# Altium schematic sheet HFPB_01, PAGE-1.SchDoc: Power Board (part 2 of 2)
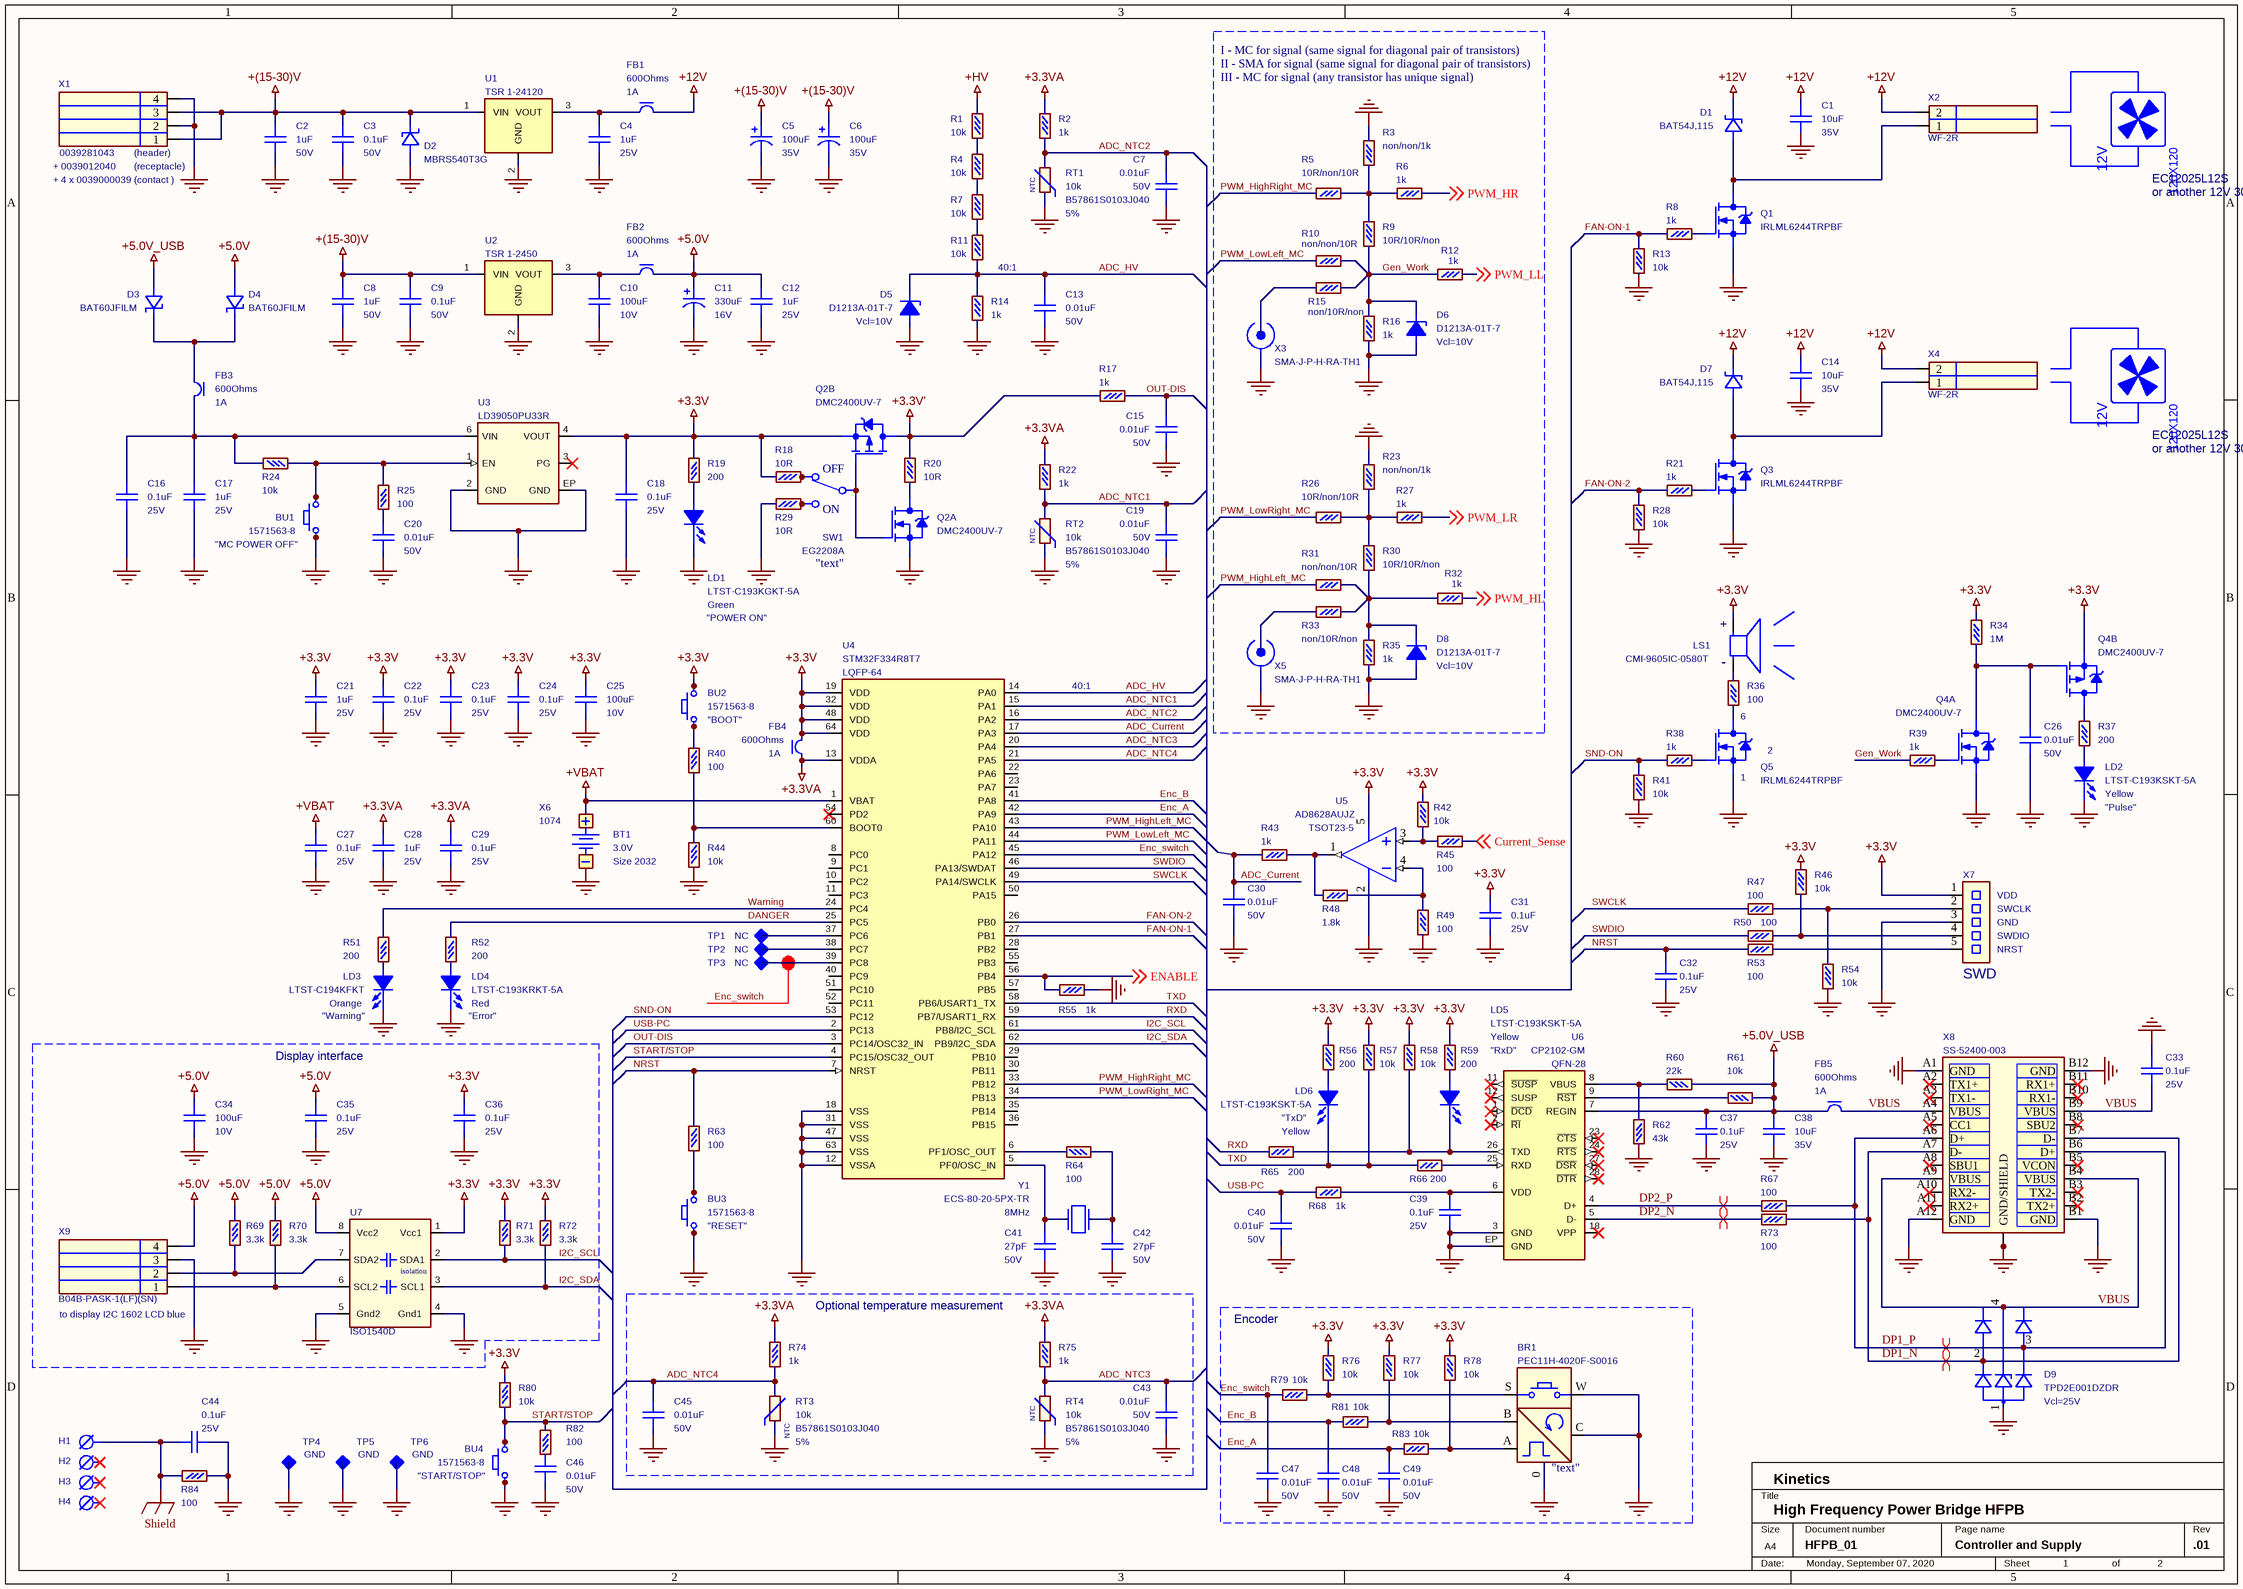
[diagram p1: HFPB_01, PAGE-1.SchDoc]

## Library data of the parts
BR1 = PEC11H-4020F-S0016: Encoder Mechanical 16 PPR; Manufacturer: BOURNS; CompType: Switch; Alternative: *; Comment for circuit: *; Datasheet link: https://www.bourns.com/docs/Product-Datasheets/PEC11H.pdf; Digikey link: https://www.digikey.com/en/products/detail/bourns-inc/PEC11H-4020F-S0016/12349534?s=N4IgTCBcDaIAoFEDCBGFAJAtAFgAxlwDFMBlXXFANhAF0BfIA; Digikey number: 118-PEC11H-4020F-S0016-ND; Mouser link: https://www.mouser.com/ProductDetail/Bourns/PEC11H-4020F-S0016?qs=%2Fha2pyFadugXOIYgpT6d2kofLXwYK1YHwuBrkfy8sJ82SNO9kJXzL6bNe4VLuBIA; Mouser number: 652-PEC11H4020FS0016; Package/Case: Through Hole; Part Description: Encoder Mechanical 16 PPR; Part number: PEC11H-4020F-S0016; Price per 1p (1), $: 2.75; Price per 1p (1000), $: 1.5
BT1 = CR2032: Battery CR2032; Manufacturer: * (Panasonic); Part Description: CR2032 Lithium; CompType: Battery 18650 Li-Pol; Value1: *mA*h; Part number: *; Value: 3.0V; Package/Case: *; Datasheet link: *; Price per 1p (1), $: *; Price per 1p (1000), $: *; Comment for circuit: *; Mouser number: *; Digikey number: *; Alternative: *; Digikey link: *; Mouser link: *
BU1-BU4 = 1571563-8: Switch tactile OFF-(ON) 0.05A 24V; Manufacturer: TE Connectivity; Part Description: Switch tactile 6.0x6.0x5.0mm; CompType: Switch; Alternative: *; Comment for circuit: *; Datasheet link: https://www.te.com/commerce/DocumentDelivery/DDEController?Action=srchrtrv&DocNm=2-1437565-7&DocType=Customer+Drawing&DocLang=English; Digikey link: https://www.digikey.com/product-detail/en/te-connectivity-alcoswitch-switches/1571563-8/450-2056-1-ND/4569746; Digikey number: 450-2056-1-ND; Mouser link: https://www.mouser.com/ProductDetail/TE-Connectivity-PB/1571563-8?qs=%2Fha2pyFaduj0OuietpPA40kWGM%2FYIDp1pjMEPmW2uQg=; Mouser number: 506-1571563-8; Package/Case: SMD 6.0x6.00; Part number: 1571563-8; Price per 1p (1), $: 0.3; Price per 1p (1000), $: 0.2
C1 C14 C38 = C1210: Capacitor 1210; Part number: C1210C106M6PACTU; Manufacturer: KEMET; Part Description: Ceramic 10uF 20% X5R 35V; Value1: 20%; Value2: X5R; CompType: Capacitor; Value: 10uF; Package/Case: SMD1210; Datasheet link: https://content.kemet.com/datasheets/KEM_C1006_X5R_SMD.pdf; Price per 1p (1), $: 0.96; Price per 1p (1000), $: 0.32; Comment for circuit: *; Mouser number: 80-C1210C106M6P; Digikey number: 399-5509-1-ND; Alternative: *; Digikey link: https://www.digikey.com/en/products/detail/kemet/C1210C106M6PACTU/1950669; Mouser link: https://www.mouser.com/ProductDetail/KEMET/C1210C106M6PACTU?qs=%2Fha2pyFaduiE5F3NeAx%252BstNZ0BfneUhBxisAs3aM8TbgY%252BzsDA%2Fe1Q%3D%3D
C2 C8 = C0603: Capacitor 0603; Part number: GRT188R61H105KE13D; Manufacturer: Murata; Part Description: Ceramic 1uF 10% X5R 50V; Value1: 10%; Value2: X5R; CompType: Capacitor; Value: 1uF; Package/Case: SMD0603; Datasheet link: https://search.murata.co.jp/Ceramy/image/img/A01X/G101/ENG/GRT188R61H105KE13-01.pdf; Price per 1p (1), $: 0.26; Price per 1p (1000), $: 0.05; Comment for circuit: *; Mouser number: 81-GRT188R61H105KE3D; Digikey number: 490-12330-1-ND; Alternative: *; Digikey link: https://www.digikey.com/en/products/detail/murata-electronics/GRT188R61H105KE13D/5416752; Mouser link: https://www.mouser.com/ProductDetail/Murata-Electronics/GRT188R61H105KE13D?qs=%2Fha2pyFaduhFE6YphrUpxtZHcvtFLtW5%252BvZuAhz4RSuwDm7lX%252BAYM08BAcXMzrSJ
C3 C9 = C0603: Capacitor 0603; Part number: C0603C104K5RAC7082; Manufacturer: KEMET; Part Description: Ceramic 0.1uF 10% X7R 50V; Value1: 10%; Value2: X7R; CompType: Capacitor; Value: 0.1uF; Package/Case: SMD0603; Datasheet link: https://content.kemet.com/datasheets/KEM_C1002_X7R_SMD.pdf; Price per 1p (1), $: 0.12; Price per 1p (1000), $: 0.02; Comment for circuit: *; Mouser number: 80-C0603C104K5R7082; Digikey number: 399-C0603C104K5RAC7082CT-ND; Alternative: *; Digikey link: https://www.digikey.com/en/products/detail/kemet/C0603C104K5RAC7082/12701309; Mouser link: https://www.mouser.com/ProductDetail/KEMET/C0603C104K5RAC7082?qs=%2Fha2pyFadugh8U7pV%252BrBGqKQVo7gfMZW%2Fweu8z7AvYympDvL%2Flu68oQ8xJ7whdD7
C4 C12 C17 C21 C28 = C0603: Capacitor 0603; Part number: C1608X7R1E105K080AB; Manufacturer: TDK; Part Description: Ceramic 1uF 10% X7R 25V; Value1: 10%; Value2: X7R; CompType: Capacitor; Value: 1uF; Package/Case: SMD0603; Datasheet link: https://product.tdk.com/en/system/files?file=dam/doc/product/capacitor/ceramic/mlcc/catalog/mlcc_commercial_general_en.pdf; Price per 1p (1), $: 0.21; Price per 1p (1000), $: 0.04; Comment for circuit: *; Mouser number: 810-C1608X7R1E105K; Digikey number: 445-5956-1-ND; Alternative: *; Digikey link: https://www.digikey.com/en/products/detail/tdk-corporation/C1608X7R1E105K080AB/2443434; Mouser link: https://www.mouser.com/ProductDetail/TDK/C1608X7R1E105K080AB?qs=%2Fha2pyFaduhbvUZXXxHSPKihux7pk%2FWVkCyG6jxauGMJh0GxUX0uaQUYqa1ofngF
C5 C6 = RL81V101MDN1KX: Capacitor Polymer Radial 100µF 35V 25mOhm; Manufacturer: Nichicon; Part Description: Polymer Radial 100µF 20% 35V 25mOhm 2000h; Value1: 2000h; Alternative: B41851F7227M000, JRB1V221M03500800120000B; Part number: RL81V101MDN1KX; Value2: 25mOhm; CompType: Capacitor; Value: 100uF; Package/Case: Radial, T/H 8.0x8.0; Datasheet link: http://nichicon-us.com/english/products/pdfs/e-rl8.pdf; Price per 1p (1), $: 2.16; Price per 1p (1000), $: 0.8; Comment for circuit: *; Mouser number: 647-RL81V101MDN1KX; Digikey number: 493-6630-1-ND; Digikey link: https://www.digikey.com/product-detail/en/nichicon/RL81V101MDN1KX/493-6630-1-ND/3466042; Mouser link: https://www.mouser.com/ProductDetail/Nichicon/RL81V101MDN1KX?qs=%2Fha2pyFadujp0wmh1eHJ4ZrOTMwlEdyH9TEHOdF6JjuEMP2hoF4V1g%3D%3D
C7 C13 C15 C19 C20 C26 C30 C40 C43 C45-C49 = C0603: Capacitor 0603; Part number: GRM1885C1H103JA01D; Manufacturer: Murata; Part Description: Ceramic 0.01uF 5% NP0 50V; Value1: 5%; Value2: NP0; CompType: Capacitor; Value: 0.01uF; Package/Case: SMD0603; Datasheet link: https://www.murata.com/-/media/webrenewal/support/library/catalog/products/capacitor/ceramiccapacitor/c02e.ashx?la=en-us&cvid=20210120024548000000; Price per 1p (1), $: 0.2; Price per 1p (1000), $: 0.04; Comment for circuit: *; Mouser number: 81-GRM1885C1H103JA1D; Digikey number: 490-9666-1-ND; Alternative: *; Digikey link: https://www.digikey.com/en/products/detail/murata-electronics/GRM1885C1H103JA01D/4421555; Mouser link: https://www.mouser.com/ProductDetail/Murata-Electronics/GRM1885C1H103JA01D?qs=%2Fha2pyFadug%2FvrC4VCXnldPdhfCgZBWBzBuM%2F5wKCqYfrzyFGWQkMbFjDTwqfUhJ
C10 C25 C34 = C1210: Capacitor 1210; Part number: C1210C107M8PACTU; Manufacturer: KEMET; Part Description: Ceramic 100uF 20% X5R 10V; Value1: 20%; Value2: X5R; CompType: Capacitor; Value: 100uF; Package/Case: SMD1210; Datasheet link: https://content.kemet.com/datasheets/KEM_C1006_X5R_SMD.pdf; Price per 1p (1), $: 1.50; Price per 1p (1000), $: 0.6; Comment for circuit: *; Mouser number: 80-C1210C107M8P; Digikey number: 399-11631-1-ND; Alternative: *; Digikey link: https://www.digikey.com/en/products/detail/kemet/C1210C107M8PACTU/4918884; Mouser link: https://www.mouser.com/ProductDetail/KEMET/C1210C107M8PACTU?qs=%2Fha2pyFaduiE5F3NeAx%252BsprSoAdidwO3b%2FrC%252BOmtqFrT1TfrhYgUKA%3D%3D
C11 = RL81C331MDN1KX: Capacitor Polymer Radial 330µF 16V 12mOhm; Manufacturer: Nichicon; Part Description: Polymer Radial 330µF 20% 16V 12mOhm 2000h; Value1: 2000h; Alternative: JRB1C681M03500800160000B; Part number: RL81C331MDN1KX; Value2: 12mOhm; CompType: Capacitor; Value: 330uF; Package/Case: Radial, T/H 9.0x8.0; Datasheet link: https://www.nichicon.co.jp/english/products/pdfs/e-rl8.pdf; Price per 1p (1), $: 0.99; Price per 1p (1000), $: 0.34; Comment for circuit: *; Mouser number: 647-RL81C331MDN1KX; Digikey number: 493-6629-1-ND; Digikey link: https://www.digikey.com/en/products/detail/nichicon/RL81C331MDN1KX/3466040; Mouser link: https://www.mouser.com/ProductDetail/Nichicon/RL81C331MDN1KX?qs=%2Fha2pyFaduhK%2FlJqlBZNyQmMLaxQ8Su7%2FtHua9Btrb7RIgwkKaRsaw%3D%3D
C16 C18 C22-C24 C27 C29 C31-C33 C35-C37 C39 C44 = C0603: Capacitor 0603; Part number: C0603C104K3RAC7082; Manufacturer: KEMET; Part Description: Ceramic 0.1uF 10% X7R 25V; Value1: 10%; Value2: X7R; CompType: Capacitor; Value: 0.1uF; Package/Case: SMD0603; Datasheet link: https://content.kemet.com/datasheets/KEM_C1002_X7R_SMD.pdf; Price per 1p (1), $: 0.11; Price per 1p (1000), $: 0.02; Comment for circuit: *; Mouser number: 80-C0603C104K3R7082; Digikey number: 399-C0603C104K3RAC7082CT-ND; Alternative: *; Digikey link: https://www.digikey.com/en/products/detail/kemet/C0603C104K3RAC7082/12700954; Mouser link: https://www.mouser.com/ProductDetail/KEMET/C0603C104K3RAC7082?qs=%2Fha2pyFadugh8U7pV%252BrBGp7heQ7z29T%252BvsWVbXyCAC0knLhltr70Nk4q6OvfRKW6
C41 C42 = C0603: Capacitor 0603; Part number: C0603C270J5GAC7411; Manufacturer: KEMET; Part Description: Ceramic 27pF 5% NP0 50V; Value1: 5%; Value2: NP0; CompType: Capacitor; Value: 27pF; Package/Case: SMD0603; Datasheet link: https://content.kemet.com/datasheets/KEM_C1003_C0G_SMD.pdf; Price per 1p (1), $: 0.10; Price per 1p (1000), $: 0.01; Comment for circuit: *; Mouser number: 80-C0603C270J5GACLR; Digikey number: 399-C0603C270J5GAC7411CT-ND; Alternative: *; Digikey link: https://www.digikey.com/en/products/detail/kemet/C0603C270J5GAC7411/12701403; Mouser link: https://www.mouser.com/ProductDetail/KEMET/C0603C270J5GAC7411?qs=%2Fha2pyFadui%252BlANwcvT18Zoh%252BwF%2FE0d%252B6131%2FziVj6iI7zgg%252B0HeRg%3D%3D
D1 D7 = BAT54J,115: Diode Schottky 30V 0.2A; Manufacturer: Nexperia; Value2: 0.8V; Part number: BAT54J,115; CompType: Diode; Package/Case: SOD-323F; Datasheet link: https://rocelec.widen.net/view/pdf/es9ugfukaw/PHGLS14913-1.pdf?t.download=true&u=5oefqw; Price per 1p (1), $: 0.24; Price per 1p (1000), $: 0.04; Comment for circuit: *; Mouser number: 771-BAT54J115; Digikey number: 1727-4818-1-ND; Alternative: *; Digikey link: https://www.digikey.com/en/products/detail/nexperia-usa-inc/BAT54J-115/1692654; Mouser link: https://www.mouser.com/ProductDetail/Nexperia/BAT54J115?qs=%2Fha2pyFadugI9ADa6WxEnxQzp3xOrOvOo4yhxZudU23LhjKFM4l8YQ%3D%3D; Value3: -; Part Description: Diode Schottky 30V 0.2A; Value1: 0.2A; Value: 30V
D2 = MBRS540T3G: Diode Schottky 40V 5A; Manufacturer: ON Semiconductor; Value2: 0.5V; Part number: MBRS540T3G; CompType: Diode; Package/Case: SMC; Datasheet link: https://www.onsemi.com/pdf/datasheet/mbrs540t3-d.pdf; Price per 1p (1), $: 0.53; Price per 1p (1000), $: 0.2; Comment for circuit: *; Mouser number: 863-MBRS540T3G; Digikey number: MBRS540T3GOSCT-ND; Alternative: *; Digikey link: https://www.digikey.com/en/products/detail/on-semiconductor/MBRS540T3G/918647; Mouser link: https://www.mouser.com/ProductDetail/ON-Semiconductor/MBRS540T3G?qs=%2Fha2pyFaduhC0LQdY%2FqVaee8bZnksvp1EwMnsoQeoVc%3D; Value3: -; Part Description: Diode Schottky 40V 5A; Value1: 5A; Value: 40V
D3 D4 = BAT60JFILM: Diode Schottky 10V 3A; Manufacturer: STM; Value2: 0.58V; Part number: BAT60JFILM; CompType: Diode; Package/Case: SOD-323; Datasheet link: https://www.st.com/content/ccc/resource/technical/document/datasheet/3d/d2/27/1d/20/e3/4d/48/CD00001944.pdf/files/CD00001944.pdf/jcr:content/translations/en.CD00001944.pdf; Price per 1p (1), $: 0.32; Price per 1p (1000), $: 0.06; Comment for circuit: *; Mouser number: 511-BAT60JFILM; Digikey number: 497-3707-1-ND; Alternative: *; Digikey link: https://www.digikey.com/en/products/detail/stmicroelectronics/BAT60JFILM/686386?s=N4IgTCBcDaIEIEEAqA2ADAKQGIEkAyAsiALoC%2BQA; Mouser link: https://www.mouser.com/ProductDetail/STMicroelectronics/BAT60JFILM?qs=%2Fha2pyFadugkQQnfwhC%2FYlghszO9A%2FCVKvGNi1XWJVA%3D; Value3: -; Part Description: Diode Schottky 10V 3A; Value1: 3A; Value: 10V
D5 D6 D8 = D1213A-01T-7: TVS Diode Vstand=3.3V Vclamp=10V; Manufacturer: Diodes Inc.; Part Description: TVS Diode Vstand=5.5V Vclamp=10V; Value: Vst=3.3V; Value3: 5A; Value1: Vbr=6V; CompType: TVS Diode; Package/Case: SOD-523; Datasheet link: https://www.diodes.com/assets/Datasheets/D1213A-01T.pdf; Price per 1p (1), $: 0.36; Price per 1p (1000), $: 0.055; Comment for circuit: *; Mouser number: 621-D1213A-01T-7; Digikey number: D1213A-01T-7DICT-ND; Alternative: *; Digikey link: https://www.digikey.com/en/products/detail/diodes-incorporated/d1213a-01t-7/3340396; Mouser link: https://www.mouser.fi/ProductDetail/Diodes-Incorporated/D1213A-01T-7?qs=%2Fha2pyFadugTbXyDDJCBKr26BLlAlDs3op5XjdvY%2F2Ix7eZK8W%2F%2Fgg%3D%3D; Part number: D1213A-01T-7
D9 = TPD2E001DZDR: TVS Diode Vstand=5.5V Vbr=11V; Manufacturer: Texas Instruments; Value: Vst=5.5V; Value3: 10A; CompType: TVS Diode; Package/Case: SOP-4; Datasheet link: https://www.ti.com/lit/ds/symlink/tpd2e001.pdf?HQS=dis-dk-null-digikeymode-dsf-pf-null-wwe&ts=1616116107965; Price per 1p (1), $: 0.62; Price per 1p (1000), $: 0.24; Comment for circuit: *; Mouser number: 595-TPD2E001DZDR; Digikey number: 296-24770-1-ND; Alternative: *; Digikey link: https://www.digikey.com/en/products/detail/texas-instruments/TPD2E001DZDR/1907454?s=N4IgTCBcDaICoAUAiYCiAGdBGJAtJASiALoC%2BQA; Mouser link: https://www.mouser.com/ProductDetail/Texas-Instruments/TPD2E001DZDR?qs=%2Fha2pyFaduhRqoDPSuaK9MWyVlIH1BetI3XLYDxSpsH9UYZtlK%2FvQA%3D%3D; Part Description: TVS Diode Vstand=5.5V Vbr=11V; Part number: TPD2E001DZDR; Value1: Vbr=11V
FB1-FB5 = MPZ1608S601ATA00: Ferrite Bead 600Ohms 1A; Manufacturer: TDK; Value2: 150mOhm; Part number: MPZ1608S601ATA00; CompType: Ferrite Bead; Value: 600Ohms; Package/Case: SMD0603; Datasheet link: https://product.tdk.com/info/en/catalog/datasheets/beads_commercial_power_mpz1608_en.pdf; Price per 1p (1), $: 0.1; Price per 1p (1000), $: 0.027; Comment for circuit: *; Mouser number: 810-MPZ1608S601ATA00; Digikey number: 445-2205-1-ND; Alternative: *; Digikey link: https://www.digikey.com/product-detail/en/tdk-corporation/MPZ1608S601ATA00/445-2205-1-ND/765103; Mouser link: https://www.mouser.com/ProductDetail/TDK/MPZ1608S601ATA00?qs=%2Fha2pyFadugcsOiFyIs3PqyLV4WV7NzmPQY%252BV8Rm%2F551LUqkOqXlQw%3D%3D; Part Description: Ferrite Bead 600Ohms 1A
H1-H4 = HOLE/3.5: HOLE 3.5mm; Part Description: Mounting hole; Value2: 4.5mm; Value1: 3.5mm; CompType: Hole; Package/Case: -; Comment for circuit: *
LD1 = LED0603: LED 0603; Manufacturer: Lite-On Inc.; Part Description: LED Green 5mA 572nm Vf=2.0V; Value3: Vf=2.0V; Value2: 16mcd; Value1: 571nm; Part number: LTST-C193KGKT-5A; CompType: LED; Package/Case: SMD0603; Datasheet link: http://optoelectronics.liteon.com/upload/download/DS22-2007-0094/LTST-C193KGKT-5A.PDF; Price per 1p (1), $: 0.39; Price per 1p (1000), $: 0.07; Comment for circuit: *; Mouser number: 859-LTSTC193KGKT5A; Digikey number: 160-1828-1-ND; Alternative: *; Digikey link: https://www.digikey.com/product-detail/en/lite-on-inc/LTST-C193KGKT-5A/160-1828-1-ND/2356247; Mouser link: https://www.mouser.com/ProductDetail/Lite-On/LTST-C193KGKT-5A?qs=%2Fha2pyFadui2fuz%252BskZlf%252BBKeUrzEFlJSpsEN%252B8irLCHIpuJXYY%252BoHVc4IEmyhNX
LD2 LD5 LD6 = LED0603: LED 0603; Manufacturer: Lite-On Inc.; Part Description: LED Yellow 5mA 591nm Vf=2.0V; Value3: Vf=2.0V; Value2: 26mcd; Value1: 591nm; Part number: LTST-C193KSKT-5A; CompType: LED; Package/Case: SMD0603; Datasheet link: https://optoelectronics.liteon.com/upload/download/DS22-2004-141/LTST-C193KSKT-5A.PDF; Price per 1p (1), $: 0.39; Price per 1p (1000), $: 0.07; Comment for circuit: *; Mouser number: 859-LTSTC193KSKT5A; Digikey number: 160-1831-1-ND; Alternative: *; Digikey link: https://www.digikey.com/en/products/detail/lite-on-inc/LTST-C193KSKT-5A/2356245?s=N4IgTCBcDaIDIBUDKCC0BhAjATgMwGkl80BWAQRAF0BfIA
  LD2 LD5: Mouser link: https://www.mouser.com/ProductDetail/Lite-On/LTST-C193KSKT-5A?qs=%2Fha2pyFadui2fuz%252BskZlf1hOnU5QqX00n%2FRxwoxNLBz4AohNkvyHxzVm0wtLxusQ
  LD6: Mouser link: https://www.mouser.fi/ProductDetail/Lite-On/LTST-C193KGKT-5A?qs=%2Fha2pyFaduj%252BwTWyfQGTE%252BESNN%2FIL38crV%2FDXvNUmN0LgmZ52X3LRw%3D%3D
LD3 = LED0603: LED 0603; Manufacturer: Lite-On Inc.; Part Description: LED Orange 5mA 605nm Vf=2.0V; Value3: Vf=2.0V; Value2: 26mcd; Value1: 605nm; Part number: LTST-C194KFKT; CompType: LED; Package/Case: SMD0603; Datasheet link: https://optoelectronics.liteon.com/upload/download/DS22-2010-0196/LTST-C194KFKT.PDF; Price per 1p (1), $: 0.39; Price per 1p (1000), $: 0.07; Comment for circuit: *; Mouser number: 859-LTST-C194KFKT; Digikey number: 160-1833-1-ND; Alternative: *; Digikey link: https://www.digikey.com/en/products/detail/lite-on-inc/LTST-C194KFKT/2356222?s=N4IgTCBcDaIDIBUDKCC0BhAjATgCwGkAxfBEAXQF8g; Mouser link: https://www.mouser.com/ProductDetail/Lite-On/LTST-C194KFKT?qs=%2Fha2pyFaduj%252BwTWyfQGTE1xnFUK4HpR8ri82Lpi85EDthVVjzq7S1A%3D%3D
LD4 = LED0603: LED 0603; Manufacturer: Lite-On Inc.; Part Description: LED Red 5mA 631nm Vf=2.0V; Value3: Vf=2.0V; Value2: 26mcd; Value1: 631nm; Part number: LTST-C193KRKT-5A; CompType: LED; Package/Case: SMD0603; Datasheet link: https://optoelectronics.liteon.com/upload/download/DS22-2005-077/LTST-C193KRKT-5A.PDF; Price per 1p (1), $: 0.39; Price per 1p (1000), $: 0.07; Comment for circuit: *; Mouser number: 859-LTSTC193KRKT5A; Digikey number: 160-1830-1-ND; Alternative: *; Digikey link: https://www.digikey.com/en/products/detail/lite-on-inc/LTST-C193KRKT-5A/2356244?s=N4IgTCBcDaIDIBUDKCC0BhAjATgMwGkAlfNAVgEEQBdAXyA; Mouser link: https://www.mouser.fi/ProductDetail/Lite-On/LTST-C193KGKT-5A?qs=%2Fha2pyFaduj%252BwTWyfQGTE%252BESNN%2FIL38crV%2FDXvNUmN0LgmZ52X3LRw%3D%3D
LS1 = CMI-9605IC-0580T: Buzzer Magnetic Audio Indicator 5V 80dB 2.7kHz; Manufacturer: CUI; Part Description: Buzzer Magnetic  5V 80dB 2.7kHz; CompType: Buzzer; Package/Case: Through hole 9.6x5.0; Alternative: *; Comment for circuit: *; Datasheet link: https://www.mouser.fi/datasheet/2/670/cmi-9605ic-0580t-1777058.pdf; Digikey link: https://www.digikey.com/product-detail/en/cui-devices/CMI-9605IC-0580T/2223-CMI-9605IC-0580T-ND/11674175; Digikey number: 2223-CMI-9605IC-0580T-ND; Mouser link: https://www.mouser.fi/ProductDetail/CUI-Devices/CMI-9605IC-0580T?qs=%2Fha2pyFaduiWDziRe0pUkXmI24fbhN7%252BQ5ghD9GyA1o5501nVMK8eg%3D%3D; Mouser number: 490-CMI-9605IC-0580T; Part number: CMI-9605IC-0580T; Price per 1p (1), $: 1.41; Price per 1p (1000), $: 0.77
Q1 Q3 Q5 = IRLML6244TRPBF: MOSFET N-channel, 20V, 21mOhm; Manufacturer: Infineon; CompType: Transistor; Part number: IRLML6244TRPBF; Price per 1p (1), $: 0.43; Price per 1p (1000), $: 0.13; Package/Case: SOT23-3; Alternative: *; Comment for circuit: *; Datasheet link: https://www.infineon.com/dgdl/irlml6244pbf.pdf?fileId=5546d462533600a4015356686fed261f; Digikey link: https://www.digikey.com/en/products/detail/infineon-technologies/IRLML6244TRPBF/2393871?s=N4IgTCBcDaIJICUAyBZJA2MAWLAVBACgEIBiIAugL5A; Mouser link: https://www.mouser.com/ProductDetail/Infineon-IR/IRLML6244TRPBF?qs=%2Fha2pyFadujeyBzDqaIaJ4NUAEeLSDgUw%2FRWGzjYGSnNi7hxyn4IcA%3D%3D; Mouser number: 942-IRLML6244TRPBF; Part Description: MOSFET N-channel, 20V, 21mOhm; Digikey number: IRLML6244TRPBFCT-ND
Q2 Q4 = DMC2400UV-7: Transistors N-channel, P-channel (Dual) MOSFET, 20V, 1A; Manufacturer: Diodes Inc.; Part Description: MOSFETs N and P-channel (Dual); 20V, 1A; ESD protected; CompType: Transistor; Part number: DMC2400UV-7; Price per 1p (1), $: 0.38; Price per 1p (1000), $: 0.08; Package/Case: SOT-563; Alternative: *; Comment for circuit: *; Datasheet link: https://www.diodes.com/assets/Datasheets/DMC2400UV.pdf; Digikey link: https://www.digikey.com/product-detail/en/diodes-incorporated/DMC2400UV-7/DMC2400UV-7DICT-ND/2918407; Mouser link: https://www.mouser.com/ProductDetail/Diodes-Incorporated/DMC2400UV-7?qs=sGAEpiMZZMshyDBzk1%2FWi5951hX7lZy1gw9GgZIwPcI%3D; Mouser number: 21-DMC2400UV-7; Digikey number: DMC2400UV-7DICT-ND
R1 R4 R7 R11 R13 R24 R28 R41 R42 R44 R46 R54 R57 R58 R61 R76-R81 R83 = R0603: Resistor 0603; Part number: ERJ-3EKF1002V; Manufacturer: Panasonic; Part Description: 10kOhm 1% 100ppm 0.1W; Value2: 100ppm; Value3: 0.1W; Value1: 1%; CompType: Resistor; Value: 10k; Package/Case: SMD0603; Datasheet link: https://industrial.panasonic.com/cdbs/www-data/pdf/RDA0000/AOA0000C304.pdf; Price per 1p (1), $: 0.1; Price per 1p (1000), $: 0.006; Comment for circuit: *; Mouser number: 667-ERJ-3EKF1002V; Digikey number: P10.0KHCT-ND; Alternative: *; Digikey link: https://www.digikey.com/product-detail/en/panasonic-electronic-components/ERJ-3EKF1002V/P10-0KHCT-ND/198102; Mouser link: https://www.mouser.com/ProductDetail/Panasonic/ERJ-3EKF1002V?qs=%2Fha2pyFaduglTbPDDZSypQEDK4AiCVGrTuiUVobO5VAELetEuVDpZg%3D%3D
R2 R3 R6 R8 R12 R14 R16 R17 R21-R23 R27 R32 R35 R38 R39 R43 R55 R68 R74 R75 = R0603: Resistor 0603; Part number: ERJ-3EKF1001V; Manufacturer: Panasonic; Part Description: 1kOhm 1% 100ppm 0.1W; Value2: 100ppm; Value3: 0.1W; Value1: 1%; CompType: Resistor; Package/Case: SMD0603; Datasheet link: https://industrial.panasonic.com/cdbs/www-data/pdf/RDA0000/AOA0000C304.pdf; Price per 1p (1), $: 0.1; Price per 1p (1000), $: 0.006; Mouser number: 667-ERJ-3EKF1001V; Digikey number: P1.00KHCT-ND; Alternative: *; Digikey link: https://www.digikey.com/product-detail/en/panasonic-electronic-components/ERJ-3EKF1001V/P1-00KHCT-ND/198071; Mouser link: https://www.mouser.com/ProductDetail/Panasonic/ERJ-3EKF1001V?qs=%2Fha2pyFaduglTbPDDZSypWE69I9nzuoo3rS5%252BQlSb3G8fLmmMx%252BY%2Fg%3D%3D
  R2 R8 R14 R21 R22 R38 R74 R75: Value: 1k; Comment for circuit: *
  R3 R23: Value: non/non/1k
  R6 R12 R16 R17 R27 R32 R35 R39 R43 R55 R68: Value: 1k
R5 R9 R10 R15 R18 R20 R26 R29-R31 R33 = R0603: Resistor 0603; Part number: ERJ-3EKF10R0V; Manufacturer: Panasonic; Part Description: 10Ohm 1% 100ppm 0.1W; Value2: 100ppm; Value3: 0.1W; Value1: 1%; CompType: Resistor; Package/Case: SMD0603; Datasheet link: https://industrial.panasonic.com/cdbs/www-data/pdf/RDA0000/AOA0000C304.pdf; Price per 1p (1), $: 0.1; Price per 1p (1000), $: 0.006; Comment for circuit: *; Mouser number: 667-ERJ-3EKF10R0V; Digikey number: P10.0HCT-ND; Alternative: *; Digikey link: https://www.digikey.com/en/products/detail/panasonic-electronic-components/ERJ-3EKF10R0V/196065?s=N4IgjCBcoMxaBjKAzAhgGwM4FMA0IB7KAbXDBggF18AHAFyhAGU6AnASwDsBzEAX3xgAbPBBJIaLHkIkQMAJwAmACwjqIeoxYce-fIoAMADgCso8ZJz4ikUmAMACAPIALALaYQ6zZBABVTnY6J2QAWWxUTABXVmw9EABaCGgxFAwrGVtwAy8BRLMUi3TpG1JFXPwE5XM0qWtZIyMheThKPnagA; Mouser link: https://www.mouser.com/ProductDetail/Panasonic/ERJ-3EKF10R0V?qs=%2Fha2pyFaduglTbPDDZSypfuBBJ3Lq12WHUiEi8qGz9yROtBrwXzvTA%3D%3D
  R5 R26: Value: 10R/non/10R
  R9 R30: Value: 10R/10R/non
  R10 R31: Value: non/non/10R
  R15 R33: Value: non/10R/non
  R18 R20 R29: Value: 10R
R19 R37 R51 R52 R56 R59 R65 R66 = R0603: Resistor 0603; Part number: ERJ-3EKF2000V; Manufacturer: Panasonic; Part Description: 200Ohm 1% 100ppm 0.1W; Value2: 100ppm; Value3: 0.1W; Value1: 1%; CompType: Resistor; Value: 200; Package/Case: SMD0603; Datasheet link: https://industrial.panasonic.com/cdbs/www-data/pdf/RDA0000/AOA0000C304.pdf; Price per 1p (1), $: 0.10; Price per 1p (1000), $: 0.006; Mouser number: 667-ERJ-3EKF2000V; Digikey number: P200HCT-ND; Alternative: *; Digikey link: https://www.digikey.com/en/products/detail/panasonic-electronic-components/ERJ-3EKF2000V/196205?s=N4IgjCBcoMxaBjKAzAhgGwM4FMA0IB7KAbXDBggF18AHAFyhAGU6AnASwDsBzEAX3xgAbPBBJIaLHkIkQMAJwAmACwjqIeoxYce-fIoAMADgCso8ZJz4ikUoYMACAPIALALaYQ6zZBABVTnY6J2QAWWxUTABXVmw9EABaCGgxFAwrGVtwAy8BRLMUi3TpGztc-ATlczSpa1kjIyF5OEo%2BNqA; Mouser link: https://www.mouser.com/ProductDetail/Panasonic/ERJ-3EKF2000V?qs=%2Fha2pyFaduglTbPDDZSypTlJuUp802sug%252BZ8t9IKAO7sPqzuSL5OBw%3D%3D
  R19 R51 R52 R56 R59: Comment for circuit: *
R25 R36 R40 R45 R47 R49 R50 R53 R63 R64 R67 R73 R82 R84 = R0603: Resistor 0603; Part number: ERJ-3EKF1000V; Manufacturer: Panasonic; Part Description: 100Ohm 1% 100ppm 0.1W; Value2: 100ppm; Value3: 0.1W; Value1: 1%; CompType: Resistor; Value: 100; Package/Case: SMD0603; Datasheet link: https://industrial.panasonic.com/cdbs/www-data/pdf/RDA0000/AOA0000C304.pdf; Price per 1p (1), $: 0.1; Price per 1p (1000), $: 0.006; Mouser number: 667-ERJ-3EKF1000V; Digikey number: P100HCT-ND; Alternative: *; Digikey link: https://www.digikey.com/product-detail/en/panasonic-electronic-components/ERJ-3EKF1000V/P100HCT-ND/198109; Mouser link: https://www.mouser.com/ProductDetail/Panasonic/ERJ-3EKF1000V?qs=%2Fha2pyFaduglTbPDDZSypXi%252B1JYi5TJRT2R7dib9ms%2F8H45gLlep%2Fg%3D%3D
  R25 R40 R45 R49 R63 R64 R82 R84: Comment for circuit: *
R34 = R0603: Resistor 0603; Part number: ERJ-U03J105V; Manufacturer: Panasonic; Part Description: 1MOhm 5% 200ppm 0.1W; Value2: 200ppm; Value3: 0.1W; Value1: 5%; CompType: Resistor; Value: 1M; Package/Case: SMD0603; Datasheet link: https://industrial.panasonic.com/cdbs/www-data/pdf/RDP0000/AOA0000C334.pdf; Price per 1p (1), $: 0.1; Price per 1p (1000), $: 0.015; Mouser number: 667-ERJ-U03J105V; Digikey number: 10-ERJ-U03J105VCT-ND; Alternative: *; Digikey link: https://www.digikey.com/en/products/detail/panasonic-electronic-components/ERJ-U03J105V/11636001?s=N4IgTCBcDaIKICUBSBaAqgBgMxIIwYFYA1EAXQF8g; Mouser link: https://ru.mouser.com/ProductDetail/Panasonic/ERJ-U03J105V?qs=%2Fha2pyFadug5vay0LVPFEGZE3WVfq9vNl60vmRtUkQUgOMaxdSjleA%3D%3D
R48 = R0603: Resistor 0603; Part number: ERJ-3EKF1801V; Manufacturer: Panasonic; Part Description: 1.8kOhm 1% 100ppm 0.1W; Value2: 100ppm; Value3: 0.1W; Value1: 1%; CompType: Resistor; Value: 1.8k; Package/Case: SMD0603; Datasheet link: https://industrial.panasonic.com/cdbs/www-data/pdf/RDA0000/AOA0000C304.pdf; Price per 1p (1), $: 0.1; Price per 1p (1000), $: 0.006; Mouser number: 667-ERJ-3EKF1801V; Digikey number: P1.80KHCT-ND; Alternative: *; Digikey link: https://www.digikey.com/en/products/detail/panasonic-electronic-components/ERJ-3EKF1801V/1746325?s=N4IgjCBcoMxaBjKAzAhgGwM4FMA0IB7KAbXDBggF18AHAFyhAGU6AnASwDsBzEAX3xgAbPBBJIaLHkIkQMAJwAmACwjqIeoxYce-fIoAMADgCso8ZJz4ikUmAB0RgAQBrAPIALALaYQ6zZAgAKqc7HRuyACy2KiYAK6s2HogALQQ0GIoGFYytuAGfgKpyuZZUtayRkZC8nCUfA1AA; Mouser link: https://ru.mouser.com/ProductDetail/Panasonic/ERJ-3EKF1801V?qs=%2Fha2pyFaduglTbPDDZSypd6kG70YScvtS%252B0EaZ%2FXQe41tVwoDQ%2FEfQ%3D%3D
R60 = R0603: Resistor 0603; Part number: ERJ-3EKF2202V; Manufacturer: Panasonic; Part Description: 22kOhm 1% 100ppm 0.1W; Value2: 100ppm; Value3: 0.1W; Value1: 1%; CompType: Resistor; Value: 22k; Package/Case: SMD0603; Datasheet link: https://industrial.panasonic.com/cdbs/www-data/pdf/RDA0000/AOA0000C304.pdf; Price per 1p (1), $: 0.1; Price per 1p (1000), $: 0.006; Comment for circuit: *; Mouser number: 667-ERJ-3EKF2202V; Digikey number: P22.0KHCT-ND; Alternative: *; Digikey link: https://www.digikey.com/en/products/detail/panasonic-electronic-components/ERJ-3EKF2202V/1746336?s=N4IgjCBcoMxaBjKAzAhgGwM4FMA0IB7KAbXDBggF18AHAFyhAGU6AnASwDsBzEAX3wAmAAwAOAKzwQSSGix5CJEIMEACANYB5ABYBbTCGoh6jAKqd2dTcgCy2VJgCurbP3wBaCNGkoMOfESQpGDChgIg7pLeMnL%2BikHKYR4ALFIxfgqBpKKiAGwAnHCUfCVAA; Mouser link: https://www.mouser.com/ProductDetail/Panasonic/ERJ-3EKF2202V?qs=%2Fha2pyFaduglTbPDDZSypU%252Bx0GcyATS6XsOLBC6vVxkNE7ErsaOWqQ%3D%3D
R62 = R0603: Resistor 0603; Part number: ERJ-3EKF4302V; Manufacturer: Panasonic; Part Description: 43kOhm 1% 100ppm 0.1W; Value2: 100ppm; Value3: 0.1W; Value1: 1%; CompType: Resistor; Value: 43k; Package/Case: SMD0603; Datasheet link: https://industrial.panasonic.com/cdbs/www-data/pdf/RDA0000/AOA0000C304.pdf; Price per 1p (1), $: 0.1; Price per 1p (1000), $: 0.006; Comment for circuit: *; Mouser number: 667-ERJ-3EKF4302V; Digikey number: P43.0KHCT-ND; Alternative: *; Digikey link: https://www.digikey.com/en/products/detail/panasonic-electronic-components/ERJ-3EKF4302V/1746411?s=N4IgjCBcoMxaBjKAzAhgGwM4FMA0IB7KAbXDBggF18AHAFyhAGU6AnASwDsBzEAX3wAmAAwAOAKzwQSSGix5CJEABYYAAgDWAeQAWAW0whqIeowCqndnS3IAstlSYArq2z98AWgjRpKDDnwiSFIwYSMBEA9JHxk5AMVgkEFwz2UpWP8FINJRUQA2AE44Sj5SoA; Mouser link: https://www.mouser.com/ProductDetail/Panasonic/ERJ-3EKF4302V?qs=%2Fha2pyFaduglTbPDDZSypVo23XfhD7yLD%252Bu9F9maZUMGPBH5Z7K5TQ%3D%3D
R69-R72 = R0603: Resistor 0603; Part number: ERJ-3EKF3301V; Manufacturer: Panasonic; Part Description: 3.3kOhm 1% 100ppm 0.1W; Value2: 100ppm; Value3: 0.1W; Value1: 1%; CompType: Resistor; Value: 3.3k; Package/Case: SMD0603; Datasheet link: https://industrial.panasonic.com/cdbs/www-data/pdf/RDA0000/AOA0000C304.pdf; Price per 1p (1), $: 0.1; Price per 1p (1000), $: 0.006; Comment for circuit: *; Mouser number: 667-ERJ-3EKF3301V; Digikey number: P3.30KHCT-ND; Alternative: *; Digikey link: https://www.digikey.com/en/products/detail/panasonic-electronic-components/ERJ-3EKF3301V/1746376?s=N4IgjCBcoMxaBjKAzAhgGwM4FMA0IB7KAbXDBggF18AHAFyhAGU6AnASwDsBzEAX3xgAbPBBJIaLHkIkQMAJwAmACwjqIeoxYce-fIoAMADgCso8ZJz4ikUjAB0MAAQBrAPIALALaYQ6zZAgAKqc7HRuyACy2KiYAK6s2HogALQQ0GIoGFYytuAGfgKpZhkW2dI2pIqF%2BCnK5llS1rJGRkLycJR83UA; Mouser link: https://www.mouser.com/ProductDetail/Panasonic/ERJ-3EKF3301V?qs=%2Fha2pyFaduglTbPDDZSypYJmhYTkVTyjfCeV0Zc08WYMnqzgMDWrag%3D%3D
RT1-RT4 = B57861S0103J040: Thermistor NTC 10k 5%; Manufacturer: TDK-EPCOS; Part Description: NTC resistor 10kOhm 5% 3988K; Value2: 3988K; Alternative: NTCG104ED104DT1X; Value3: 60mW; CompType: Thermistor; Value: 10k; Package/Case: Through hole; Datasheet link: https://www.tdk-electronics.tdk.com/inf/50/db/ntc/NTC_Mini_sensors_S861.pdf; Price per 1p (1), $: 1.89; Price per 1p (1000), $: 0.8; Comment for circuit: *; Mouser number: 871-B57861S103J40; Digikey number: 495-75200-ND; Digikey link: https://www.digikey.com/en/products/detail/epcos-tdk-electronics/B57861S0103J040/3500452?s=N4IgTCBcDaIEIFYDsAOAbARgMoAYM4GYApHAFhxAF0BfIA; Mouser link: https://www.mouser.com/ProductDetail/EPCOS-TDK/B57861S0103J040?qs=%2Fha2pyFadujntv0e0iDVKOWqU6ne%252BuLwIPAsv4SnY6MEOfaNDodXpA%3D%3D; Part number: B57861S0103J040
SW1 = EG2208A: Switch ON-ON 0.3A 50V; Manufacturer: E-Switch; CompType: Switch; Alternative: *; Comment for circuit: *; Datasheet link: https://sten-eswitch-13110800-production.s3.amazonaws.com/system/asset/product_line/data_sheet/119/EG.pdf; Digikey link: https://www.digikey.com/en/products/detail/e-switch/EG2208A/301964?s=N4IgTCBcDaIKIHExgAwA4CCIC6BfIA; Digikey number: EG1942-ND; Mouser link: https://www.mouser.com/ProductDetail/E-Switch/EG2208A?qs=%2Fha2pyFadugmSmP5bEvz77wGRyMPQnrU%2F%2FKuNM2THIw%3D; Mouser number: 612-EG2208A; Package/Case: Through Hole, Right Angle; Part Description: Switch ON-ON 0.3A 50V; Part number: EG2208A; Price per 1p (1), $: 0.82; Price per 1p (1000), $: 0.5
TP1-TP6 = TEST POINT: Value1: 0.8mm; Value2: 1.4mm; CompType: Hole; Package/Case: -; Comment for circuit: *; Part Description: *
  TP1-TP3: Value: NC
  TP4-TP6: Value: GND
U1 = TSR 1-24120: DC/DC Conv., Non-Iso, 12V, 1A; Manufacturer: Traco Power; CompType: DC/DC Converters; Package/Case: SIP-3; Alternative: *; Comment for circuit: *; Datasheet link: https://www.tracopower.com/sites/default/files/products/datasheets/tsr1_datasheet.pdf; Digikey link: https://www.digikey.com/en/products/detail/traco-power/TSR-1-24120/9383773; Digikey number: 1951-2739-ND; Mouser link: https://www.mouser.com/ProductDetail/TRACO-Power/TSR-1-24120?qs=ckJk83FOD0XFyuKFnkiJHw%3D%3D; Mouser number: 495-TSR-1-24120; Part Description: DC/DC Conv., Non-Iso, 12V, 1A; Part number: TSR 1-24120; Price per 1p (1), $: 5.5; Price per 1p (1000), $: 4.1
U2 = TSR 1-2450: DC/DC Conv., Non-Iso, 5.0V, 1A; Manufacturer: Traco Power; CompType: DC/DC Converters; Package/Case: SIP-3; Alternative: *; Comment for circuit: *; Datasheet link: https://www.tracopower.com/sites/default/files/products/datasheets/tsr1_datasheet.pdf; Digikey link: https://www.digikey.com/en/products/detail/traco-power/TSR-1-2450/9383780; Digikey number: 1951-2747-ND; Mouser link: https://www.mouser.com/ProductDetail/TRACO-Power/TSR-1-2450?qs=ckJk83FOD0XFKqda0Mzkgw%3D%3D; Mouser number: 495-TSR-1-2450; Part Description: DC/DC Conv., Non-Iso, 5.0V, 1A; Part number: TSR 1-2450; Price per 1p (1), $: 5.5; Price per 1p (1000), $: 4.1
U3 = LD39050PU33R: LDO 3.3V 500mA; Manufacturer: STM; CompType: Integrated circuit; Package/Case: DFN-6; Alternative: *; Comment for circuit: *; Datasheet link: https://www.st.com/content/ccc/resource/technical/document/datasheet/12/43/cc/93/21/f6/41/66/CD00227527.pdf/files/CD00227527.pdf/jcr:content/translations/en.CD00227527.pdf; Digikey link: https://www.digikey.com/en/products/detail/stmicroelectronics/LD39050PU33R/2039876; Digikey number: 497-8716-1-ND; Mouser link: https://www.mouser.com/ProductDetail/STMicroelectronics/LD39050PU33R?qs=%2Fha2pyFadujCURFU6JT6zdCg5MoSZujIJpCj1jzTgayb3edzjbabLA%3D%3D; Mouser number: 511-LD39050PU33R; Part Description: LDO 3.3V 500mA; Part number: LD39050PU33R; Price per 1p (1), $: 1.15; Price per 1p (1000), $: 0.58
U4 = STM32F334R8T7: ARM Cortex-M4+ STM32F3 Microcontroller IC 32-Bit 72MHz 64KB; Manufacturer: STMicroelectronics; CompType: Integrated circuit; Alternative: *; Comment for circuit: *; Datasheet link: https://www.st.com/content/ccc/resource/technical/document/datasheet/d1/cd/3d/18/a2/2c/4e/d0/DM00097745.pdf/files/DM00097745.pdf/jcr:content/translations/en.DM00097745.pdf; Digikey link: https://www.digikey.com/en/products/detail/stmicroelectronics/STM32F334R8T7/5268274; Digikey number: 497-18933-ND; Mouser link: https://www.mouser.com/ProductDetail/STMicroelectronics/STM32F334R8T7?qs=9MuLHSklicpmYDk0V9oFMQ%3D%3D; Mouser number: 511-STM32F334R8T7; Part Description: Microcontroller IC 32-Bit 72MHz 64KB; Part number: STM32F334R8T7; Price per 1p (1), $: 7.17; Price per 1p (1000), $: 4.0
U5 = AD8628AUJZ: OpAmp Rail-to-Rail 1 Channel; Manufacturer: Analog Devices; CompType: Integrated circuit; Alternative: *; Comment for circuit: *; Datasheet link: https://www.analog.com/media/en/technical-documentation/data-sheets/AD8628_8629_8630.pdf; Digikey link: https://www.digikey.com/en/products/detail/analog-devices-inc/AD8628AUJZ-REEL7/996267; Digikey number: AD8628AUJZ-REEL7CT-ND; Mouser link: https://www.mouser.com/ProductDetail/Analog-Devices/AD8628AUJZ-REEL7?qs=%2FtpEQrCGXCwiRJmva1wT4g%3D%3D; Mouser number: 584-AD8628AUJZ-R7; Part Description: OpAmp Rail-to-Rail 1 Channel; Part number: AD8628AUJZ; Price per 1p (1), $: 2.63; Price per 1p (1000), $: 1.28
U6 = CP2102-GM: Interface USB to UART; Manufacturer: Silicon Labs; CompType: Integrated circuit; Alternative: *; Comment for circuit: *; Datasheet link: https://www.silabs.com/documents/public/data-sheets/CP2102-9.pdf; Digikey link: https://www.digikey.com/en/products/detail/silicon-labs/CP2102-GM/696598; Digikey number: 336-1160-5-ND; Mouser link: https://www.mouser.com/ProductDetail/Silicon-Labs/CP2102-GM?qs=yHCtFi5ROqJvCcyR88R4Pg%3D%3D; Mouser number: 634-CP2102-GM; Part Description: Interface USB to UART; Part number: CP2102-GM; Price per 1p (1), $: 3.5; Price per 1p (1000), $: 1.5
U7 = ISO1540D: Digital Isolator I2C 2500Vrms 2 Channel 1Mbps; Manufacturer: Silicon Labs; CompType: Integrated circuit; Package/Case: SOIC-8; Alternative: *; Comment for circuit: *; Datasheet link: https://www.ti.com/lit/ds/symlink/iso1540-q1.pdf?ts=1615839581838; Digikey link: https://www.digikey.com/en/products/detail/texas-instruments/ISO1540D/3601070; Digikey number: 296-34896-5-ND; Mouser link: https://www.mouser.com/ProductDetail/Texas-Instruments/ISO1540D?qs=rg6Iqu58vpWvO86XnJi3%2Fg%3D%3D; Mouser number: 595-ISO1540D; Part Description: Digital Isolator I2C 2500Vrms 2 Channel 1Mbps; Part number: ISO1540D; Price per 1p (1), $: 5.73; Price per 1p (1000), $: 2.87
X1 = 0353170420: Connector Header 4 pin; Manufacturer: Molex; Mating with: 0039012040 + 4 x (0039000039); CompType: Connector; Alternative: *; Comment for circuit: *; Datasheet link: https://www.molex.com/pdm_docs/sd/039281043_sd.pdf; Digikey link: https://www.digikey.com/en/products/detail/molex/0039281043/61400; Digikey number: WM3801-ND; Mouser link: https://www.mouser.com/ProductDetail/Molex/39-28-1043?qs=LQQHZ4xw2XCMHoV0KRLGhg%3D%3D; Mouser number: 538-39-28-1043; Package/Case: Through Hole; Part Description: Connector Header 4 pin; Part number: 0039281043; Price per 1p (1), $: 0.75; Price per 1p (1000), $: 0.38
X2 X4 = WF-2R: Connector 2 pin, Right angle, 2.54mm; Manufacturer: Connfly; Text: "text"; CompType: Connector; Alternative: *; Comment for circuit: *; Digikey link: -; Digikey number: -; Mouser link: -; Mouser number: -; Package/Case: Through Hole; Part Description: Connector 2 pin, Right angle, 2.54mm; Part number: WF-2R; Price per 1p (1), $: 0.15; Price per 1p (1000), $: 0.05
X3 X5 = SMA-J-P-H-RA-TH1: SMA Jack, Socket, Right Angle 50Ohm; Manufacturer: Samtec; CompType: Connector; Mating with: SMA-P-C-H-ST-CA1; Alternative: *; Comment for circuit: *; Datasheet link: http://suddendocs.samtec.com/catalog_english/sma.pdf; Digikey link: https://www.digikey.com/en/products/detail/samtec-inc/SMA-J-P-H-RA-TH1/2664715; Digikey number: SAM8856-ND; Mouser link: https://www.mouser.com/ProductDetail/Samtec/SMA-J-P-H-RA-TH1?qs=%2Fha2pyFaduido7R%252BdeDRif5LX8zAwyx4ING7VZyWTo4ZBEJ7ms8AgA%3D%3D; Mouser number: 200-SMAJPHRATH1; Package/Case: Through Hole; Part Description: SMA Jack, Socket, Right Angle 50Ohm; Part number: SMA-J-P-H-RA-TH1; Price per 1p (1), $: 6.2; Price per 1p (1000), $: 3.6
X6 = 1074: Battery holder for CR2032; Manufacturer: Keystone; CompType: Connector; Package/Case: Trough Hole-3; Alternative: *; Comment for circuit: *; Datasheet link: http://www.keystoneelectronics.net/ENG._DEPT/WEB_ORACLE/PDF/PDF%20CAT%20NO%20DRAWINGS/1000-1999/1074.PDF; Digikey link: https://www.digikey.com/en/products/detail/keystone-electronics/1074/9921784; Digikey number: 36-1074-ND; Mouser link: https://www.mouser.com/ProductDetail/Keystone-Electronics/1074?qs=u16ybLDytRZ%2FZj7HSRmD5g%3D%3D; Mouser number: 534-1074; Part Description: Battery holder for CR2032; Part number: 1074; Price per 1p (1), $: 0.63; Price per 1p (1000), $: 0.37
X7 = CONNECTOR-5 (2mm): Connector 5 holes 2mm; Value1: 0.8mm; Value2: 1.4mm; CompType: Connector; Value: SWD; Package/Case: -; Comment for circuit: *; Part Description: *
X8 = SS-52400-003: USB Type-C, Right Angle Receptacle 24 Position; Manufacturer: Stewart; CompType: Connector; Digikey link: https://www.digikey.com/en/products/detail/stewart-connector/SS-52400-003/11205655?s=N4IgTCBcDaIMpwLQFYwBYAMHFYMwgF0BfIA; Mouser link: https://www.mouser.com/ProductDetail/Stewart-Connector-Bel/SS-52400-003?qs=%2Fha2pyFaduih8cH%2F%2FY%2Fy80F9lcyWJekbo3AebMFU7YTl3sJ3rKtpvg%3D%3D; Mouser number: 530-SS-52400-003; Part Description: USB Type-C, Right Angle Receptacle 24 Position; Mating with: USB Type-C; Datasheet link: https://belfuse.com/resources/drawings/stewartconnector/dr-stw-ss-52400-003.pdf; Package/Case: SMD+TH; Comment for circuit: *; Alternative: *; Digikey number: 380-SS-52400-003CT-ND; Part number: SS-52400-003; Price per 1p (1), $: 2.25; Price per 1p (1000), $: 1.25
X9 = B04B-PASK-1(LF)(SN): Connector Header 4 pins, 2.0mm; Manufacturer: JST; Mating with: PAP-04V-S; CompType: Connector; Alternative: *; Comment for circuit: *; Datasheet link: http://www.jst-mfg.com/product/pdf/eng/ePA-F.pdf; Digikey link: https://www.digikey.com/en/products/detail/jst-sales-america-inc/B04B-PASK-1-LF-SN/926740; Digikey number: 455-1834-ND; Mouser link: -; Mouser number: -; Package/Case: Through Hole; Part Description: Connector Header 4 pins, 2.0mm; Part number: B04B-PASK-1(LF)(SN); Price per 1p (1), $: 0.34; Price per 1p (1000), $: 0.16
Y1 = ECS-80-20-5PX-TR: Crystal 8MHz; Manufacturer: ECS Inc.; Part Description: Crystal 8MHz 20pF 30ppm; Value2: 30ppm; Value3: 60Ohm; Value1: 20pF; Part number: ECS-80-20-5PX-TR; CompType: Crystal; Value: 8MHz; Package/Case: HC-49/US; Datasheet link: https://ecsxtal.com/store/pdf/csm-7x.pdf; Price per 1p (1), $: 0.30; Price per 1p (1000), $: 0.18; Comment for circuit: *; Mouser number: 520-80-20-5PX-T; Digikey number: XC2076CT-ND; Alternative: *; Digikey link: https://www.digikey.com/product-detail/en/ecs-inc/ECS-80-20-5PX-TR/XC2076CT-ND/5875560; Mouser link: https://www.mouser.com/ProductDetail/ECS/ECS-80-20-5PX-TR?qs=wYonFgBYHKlzFXpOtPA%2FIw%3D%3D